# EAGLE schematic legatus_v0_2_with_notes (EAGLE 9.6.2)
CNAME: Parrot Teensy Board; CREVISION: 1.0; DESIGNER: Nathan Villicana-Shaw
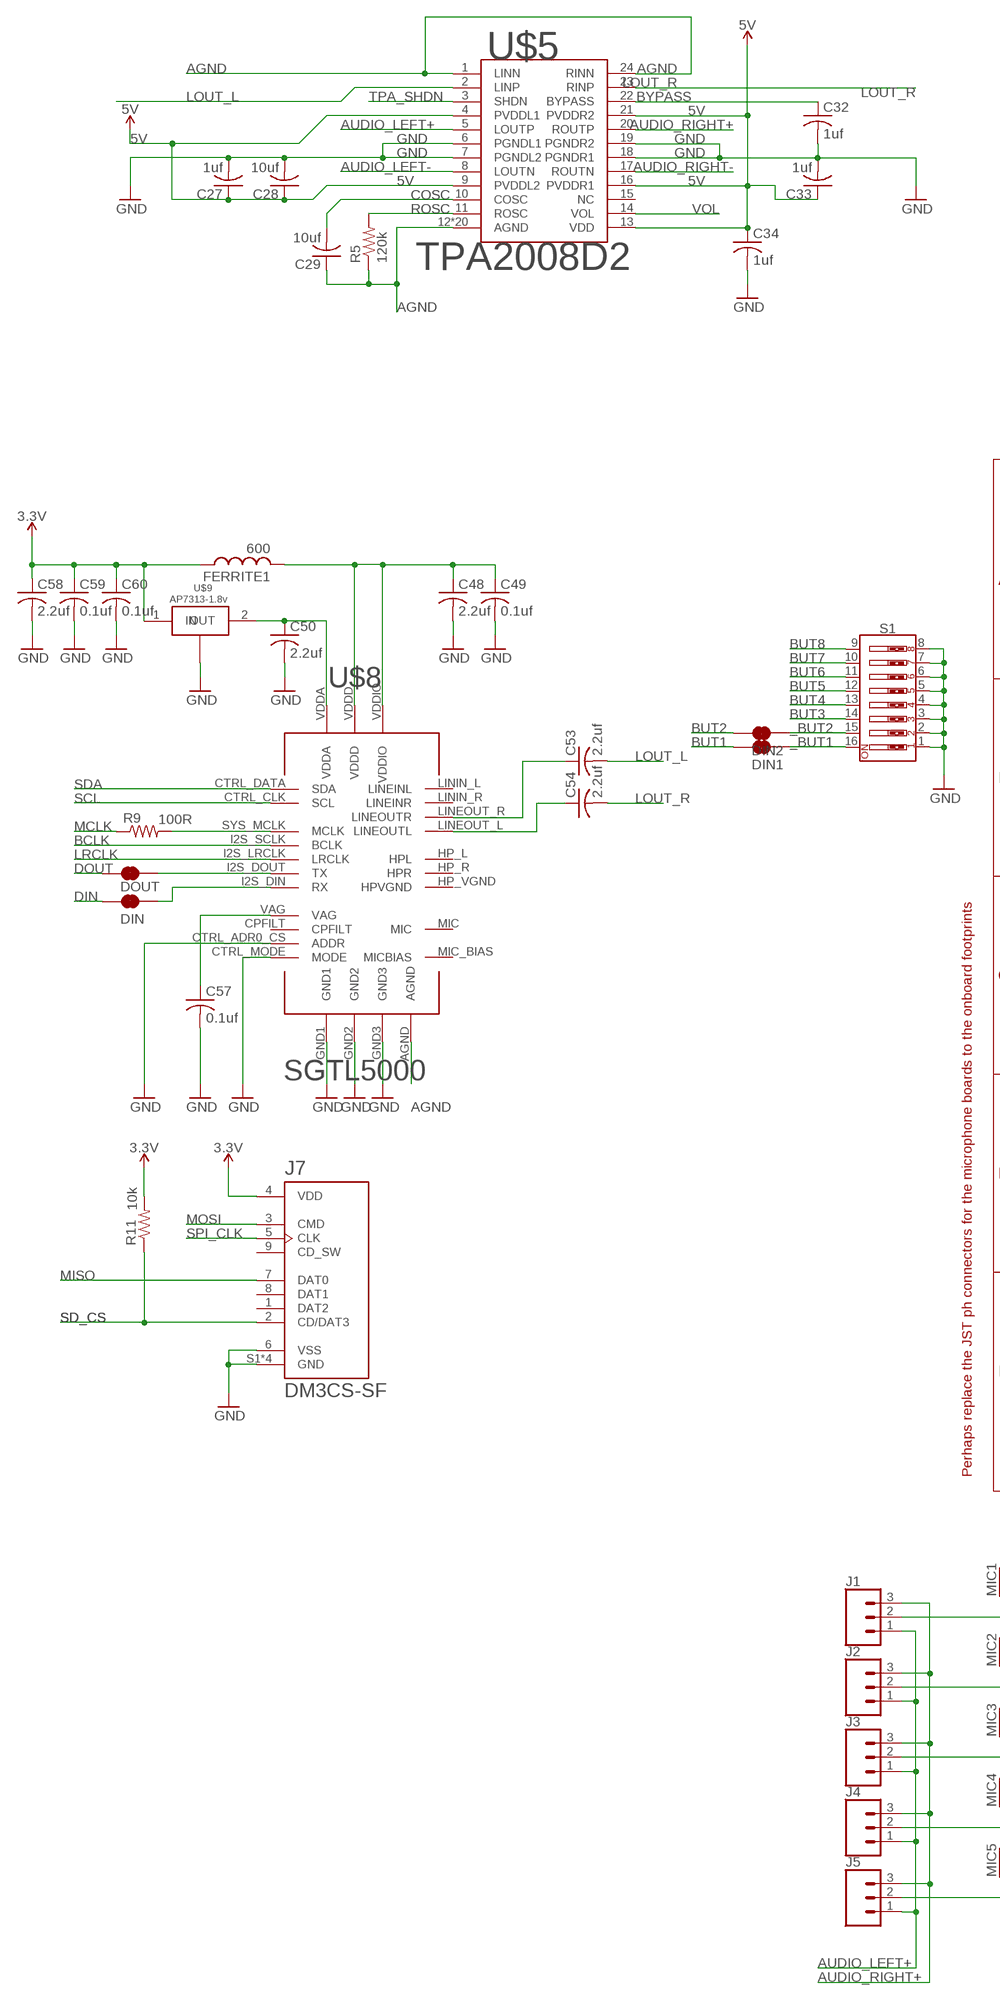
[diagram p0: schematic, sheet 1, part 1 of 2]
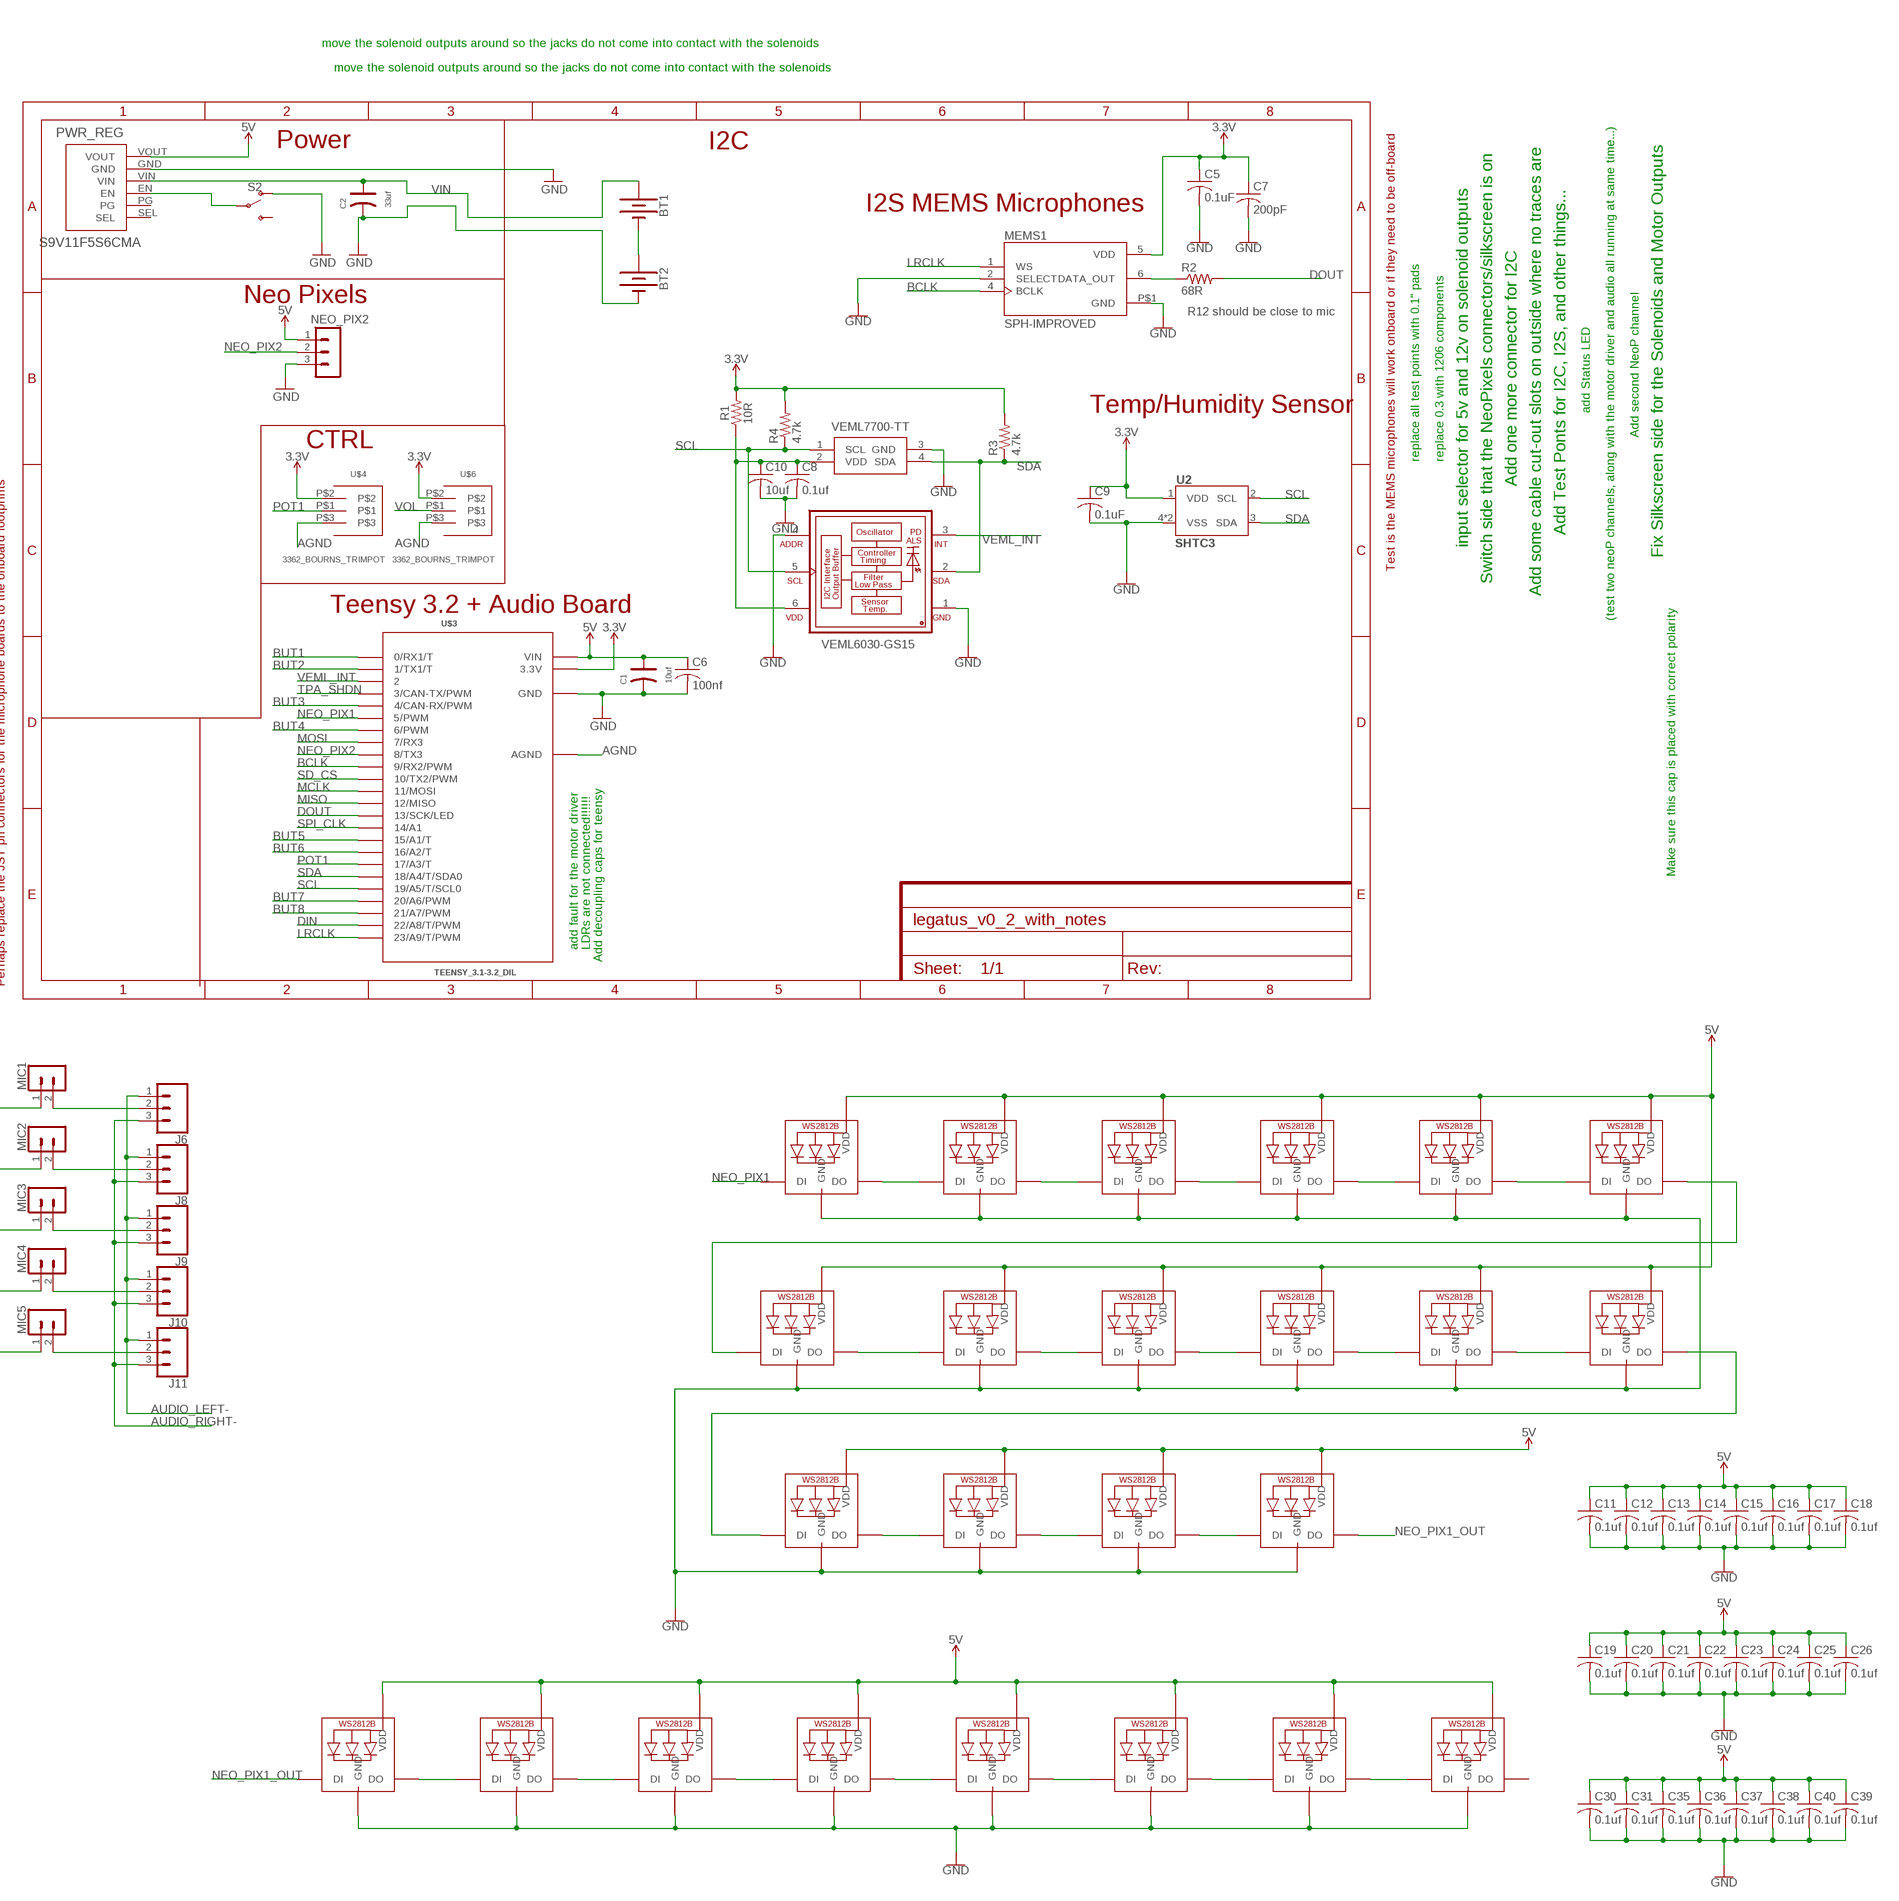
[diagram p1: schematic, sheet 1, part 2 of 2]

## Parts
BT1  BATTERY-18650  [BATTERY_18650-HOLDER]
BT2  BATTERY-18650  [BATTERY_18650-HOLDER]
C1  10uf  DIP-ALUMINUM-47UF-16V(D5-H7MM)  [PC-D5.3MM]
C2  33uf  DIP-ALUMINUM-47UF-16V(D5-H7MM)  [PC-D5.3MM]
C5  0.1uF  C-USC0805  [C0805]
C6  100nf  C-USC2012  [C2012]
C7  200pF  C-USC0805  [C0805]
C8  0.1uf  C-USC0805  [C0805]
C9  0.1uF  C-USC0805  [C0805]
C10  10uf  C-USC0805  [C0805]
C11  0.1uf  C-USC0805  [C0805]
C12  0.1uf  C-USC0805  [C0805]
C13  0.1uf  C-USC0805  [C0805]
C14  0.1uf  C-USC0805  [C0805]
C15  0.1uf  C-USC0805  [C0805]
C16  0.1uf  C-USC0805  [C0805]
C17  0.1uf  C-USC0805  [C0805]
C18  0.1uf  C-USC0805  [C0805]
C19  0.1uf  C-USC0805  [C0805]
C20  0.1uf  C-USC0805  [C0805]
C21  0.1uf  C-USC0805  [C0805]
C22  0.1uf  C-USC0805  [C0805]
C23  0.1uf  C-USC0805  [C0805]
C24  0.1uf  C-USC0805  [C0805]
C25  0.1uf  C-USC0805  [C0805]
C26  0.1uf  C-USC0805  [C0805]
C27  1uf  C-USC0805  [C0805]
C28  10uf  C-USC0805  [C0805]
C29  10uf  C-USC0805  [C0805]
C30  0.1uf  C-USC0805  [C0805]
C31  0.1uf  C-USC0805  [C0805]
C32  1uf  C-USC0805  [C0805]
C33  1uf  C-USC0805  [C0805]
C34  1uf  C-USC0805  [C0805]
C35  0.1uf  C-USC0805  [C0805]
C36  0.1uf  C-USC0805  [C0805]
C37  0.1uf  C-USC0805  [C0805]
C38  0.1uf  C-USC0805  [C0805]
C39  0.1uf  C-USC0805  [C0805]
C40  0.1uf  C-USC0805  [C0805]
C48  2.2uf  C-USC0805  [C0805]
C49  0.1uf  C-USC0805  [C0805]
C50  2.2uf  C-USC0805  [C0805]
C53  2.2uf  C-USC0805  [C0805]
C54  2.2uf  C-USC0805  [C0805]
C57  0.1uf  C-USC0805  [C0805]
C58  2.2uf  C-USC0805  [C0805]
C59  0.1uf  C-USC0805  [C0805]
C60  0.1uf  C-USC0805  [C0805]
DIN  JUMPER-SMT_2_NC_TRACE_SILK  [SMT-JUMPER_2_NC_TRACE_SILK]
DIN1  JUMPER-SMT_2_NC_TRACE_SILK  [SMT-JUMPER_2_NC_TRACE_SILK]
DIN2  JUMPER-SMT_2_NC_TRACE_SILK  [SMT-JUMPER_2_NC_TRACE_SILK]
DOUT  JUMPER-SMT_2_NC_TRACE_SILK  [SMT-JUMPER_2_NC_TRACE_SILK]
FERRITE1  600  INDUCTOR_0805_N  [RESC0805_N]
J1  CONN_03  [1X03]
J2  CONN_03  [1X03]
J3  CONN_03  [1X03]
J4  CONN_03  [1X03]
J5  CONN_03  [1X03]
J6  CONN_03  [1X03]
J7  DM3CS-SF  [HRS_DM3CS-SF]
J8  CONN_03  [1X03]
J9  CONN_03  [1X03]
J10  CONN_03  [1X03]
J11  CONN_03  [1X03]
LED1  WS2812B_5050N  [WS2812B-NARROW]
LED2  WS2812B_5050N  [WS2812B-NARROW]
LED3  WS2812B_5050N  [WS2812B-NARROW]
LED4  WS2812B_5050N  [WS2812B-NARROW]
LED5  WS2812B_5050N  [WS2812B-NARROW]
LED6  WS2812B_5050N  [WS2812B-NARROW]
LED7  WS2812B_5050N  [WS2812B-NARROW]
LED8  WS2812B_5050N  [WS2812B-NARROW]
LED9  WS2812B_5050N  [WS2812B-NARROW]
LED10  WS2812B_5050N  [WS2812B-NARROW]
LED11  WS2812B_5050N  [WS2812B-NARROW]
LED12  WS2812B_5050N  [WS2812B-NARROW]
LED13  WS2812B_5050N  [WS2812B-NARROW]
LED14  WS2812B_5050N  [WS2812B-NARROW]
LED15  WS2812B_5050N  [WS2812B-NARROW]
LED16  WS2812B_5050N  [WS2812B-NARROW]
LED17  WS2812B_5050N  [WS2812B-NARROW]
LED18  WS2812B_5050N  [WS2812B-NARROW]
LED19  WS2812B_5050N  [WS2812B-NARROW]
LED20  WS2812B_5050N  [WS2812B-NARROW]
LED21  WS2812B_5050N  [WS2812B-NARROW]
LED22  WS2812B_5050N  [WS2812B-NARROW]
LED23  WS2812B_5050N  [WS2812B-NARROW]
LED24  WS2812B_5050N  [WS2812B-NARROW]
MEMS1  SPH-IMPROVED  [MIC_SPH0645LM4H-B_LARGER_RING]
MIC1  B2B-PH-K  [B2B-PH-K]
MIC2  B2B-PH-K  [B2B-PH-K]
MIC3  B2B-PH-K  [B2B-PH-K]
MIC4  B2B-PH-K  [B2B-PH-K]
MIC5  B2B-PH-K  [B2B-PH-K]
NEO_PIX2  B3B-PH-K  [B3B-PH-K]
PWR_REG  S9V11F5S6CMA  [S9V11F3S5CMA]
R1  10R  R-US_R0805  [R0805]
R2  68R  R-US_M0805  [M0805]
R3  4.7k  R-US_M0805  [M0805]
R4  4.7k  R-US_M0805  [M0805]
R5  120k  R-US_M0805  [M0805]
R9  100R  R-US_M0805  [M0805]
R11  10k  R-US_M0805  [M0805]
S1  DIP-08-PTH  [DIPSWITCH-08]
S2  SWITCH-SPDT-PTH-11.6X4.0MM-LOCK  [SWITCH_SPDT_PTH_11.6X4.0MM_LOCK]
U2  SHTC3  [SHTC3]
U$3  TEENSY_3.1-3.2_DIL  [TEENSY_3.0-3.2&LC_DIL]
U$4  3362_BOURNS_TRIMPOT  [3362_BOURNS_TRIMPOT]
U$5  TPA2008D2  [PWP-TSSOP24]
U$6  3362_BOURNS_TRIMPOT  [3362_BOURNS_TRIMPOT]
U$8  SGTL5000  [QFN-32-5X5MM]
U$9  AP7313-1.8v  AP7313  [SOT-23]
VEML1  VEML7700-TT  [VEML7700]
VMEL1  VEML6030-GS15  [VISHAY_VEML6030_2X2X0.87]

## Nets
3.3V [3.3V]: C5.1 C7.1 C9.1 C58.1 C59.1 C60.1 FERRITE1.1 J7.4(VDD) MEMS1.5(VDD) R1.2 R3.2 R4.2 R11.2 U2.1(VDD) U$3.3.3V U$4.P$2 U$6.P$2 U$9.1(IN)
5V: C1.+ C6.1 C11.1 C12.1 C13.1 C14.1 C15.1 C16.1 C17.1 C18.1 C19.1 C20.1 C21.1 C22.1 C23.1 C24.1 C25.1 C26.1 C27.1 C28.1 C30.1 C31.1 C33.1 C34.1 C35.1 C36.1 C37.1 C38.1 C39.1 C40.1 LED1.1-VDD(VDD) LED2.1-VDD(VDD) LED3.1-VDD(VDD) LED4.1-VDD(VDD) LED5.1-VDD(VDD) LED6.1-VDD(VDD) LED7.1-VDD(VDD) LED8.1-VDD(VDD) LED9.1-VDD(VDD) LED10.1-VDD(VDD) LED11.1-VDD(VDD) LED12.1-VDD(VDD) LED13.1-VDD(VDD) LED14.1-VDD(VDD) LED15.1-VDD(VDD) LED16.1-VDD(VDD) LED17.1-VDD(VDD) LED18.1-VDD(VDD) LED19.1-VDD(VDD) LED20.1-VDD(VDD) LED21.1-VDD(VDD) LED22.1-VDD(VDD) LED23.1-VDD(VDD) LED24.1-VDD(VDD) NEO_PIX2.1 PWR_REG.VOUT U$3.VIN U$5.4(PVDDL1) U$5.9(PVDDL2) U$5.13(VDD) U$5.16(PVDDR1) U$5.21(PVDDR2)
_BUT1: DIN1.2 S1.16
_BUT2: DIN2.2 S1.15
AGND: C29.1 R5.1 U$3.AGND U$4.P$3 U$5.1(LINN) U$5.12(AGND) U$5.24(RINN) U$5.EXP(AGND) U$5.EXP@1(AGND) U$5.EXP@2(AGND) U$5.EXP@3(AGND) U$5.EXP@4(AGND) U$5.EXP@5(AGND) U$5.EXP@6(AGND) U$5.EXP@7(AGND) U$5.EXP@8(AGND) U$5.EXP@9(AGND) U$5.EXP@10(AGND) U$5.EXP@11(AGND) U$5.EXP@12(AGND) U$5.EXP@13(AGND) U$5.EXP@14(AGND) U$5.EXP@15(AGND) U$5.EXP@16(AGND) U$5.EXP@17(AGND) U$5.EXP@18(AGND) U$6.P$3 U$8.AGND
AUDIO_LEFT+: J1.1 J2.1 J3.1 J4.1 J5.1 U$5.5(LOUTP)
AUDIO_LEFT-: J6.1 J8.1 J9.1 J10.1 J11.1 U$5.8(LOUTN)
AUDIO_RIGHT+: J1.3 J2.3 J3.3 J4.3 J5.3 U$5.20(ROUTP)
AUDIO_RIGHT-: J6.3 J8.3 J9.3 J10.3 J11.3 U$5.17(ROUTN)
BCLK: MEMS1.4(BCLK) U$3.9(9/RX2/PWM) U$8.I2S_SCLK(BCLK)
BUT1: DIN1.1 U$3.0(0/RX1/T)
BUT2: DIN2.1 U$3.1(1/TX1/T)
BUT3: S1.14 U$3.4(4/CAN-RX/PWM)
BUT4: S1.13 U$3.6(6/PWM)
BUT5: S1.12 U$3.15/A1(15/A1/T)
BUT6: S1.11 U$3.16/A2(16/A2/T)
BUT7: S1.10 U$3.20/A6(20/A6/PWM)
BUT8: S1.9 U$3.21/A7(21/A7/PWM)
BYPASS: C32.1 U$5.22(BYPASS)
COSC: C29.2 U$5.10(COSC)
DIN: DIN.1 U$3.22/A8(22/A8/T/PWM)
DOUT: DOUT.1 R2.2 U$3.13(13/SCK/LED)
EDITROUTE: C48.1 C49.1 FERRITE1.2 U$8.VDDD U$8.VDDIO
GND: BT2.GND@1(-) C1.- C2.- C5.2 C6.2 C7.2 C8.2 C9.2 C10.2 C11.2 C12.2 C13.2 C14.2 C15.2 C16.2 C17.2 C18.2 C19.2 C20.2 C21.2 C22.2 C23.2 C24.2 C25.2 C26.2 C27.2 C28.2 C30.2 C31.2 C32.2 C33.2 C34.2 C35.2 C36.2 C37.2 C38.2 C39.2 C40.2 C48.2 C49.2 C50.2 C57.2 C58.2 C59.2 C60.2 J7.6(VSS) J7.S1(GND) J7.S2(GND) J7.S3(GND) J7.S5(GND) LED1.3-GND(GND) LED2.3-GND(GND) LED3.3-GND(GND) LED4.3-GND(GND) LED5.3-GND(GND) LED6.3-GND(GND) LED7.3-GND(GND) LED8.3-GND(GND) LED9.3-GND(GND) LED10.3-GND(GND) LED11.3-GND(GND) LED12.3-GND(GND) LED13.3-GND(GND) LED14.3-GND(GND) LED15.3-GND(GND) LED16.3-GND(GND) LED17.3-GND(GND) LED18.3-GND(GND) LED19.3-GND(GND) LED20.3-GND(GND) LED21.3-GND(GND) LED22.3-GND(GND) LED23.3-GND(GND) LED24.3-GND(GND) MEMS1.2(SELECT) MEMS1.P$1(GND) NEO_PIX2.3 PWR_REG.GND S1.1 S1.2 S1.3 S1.4 S1.5 S1.6 S1.7 S1.8 S2.1(O) U2.4(VSS) U2.5(VSS) U$3.GND U$5.6(PGNDL1) U$5.7(PGNDL2) U$5.18(PGNDR1) U$5.19(PGNDR2) U$8.CTRL_ADR0_CS(ADDR) U$8.CTRL_MODE(MODE) U$8.GND1 U$8.GND2 U$8.GND3 U$9.3(GND) VEML1.3(GND) VMEL1.1(GND) VMEL1.4(ADDR)
LOUT_L: C53.2 U$5.2(LINP)
LOUT_R: C54.2 U$5.23(RINP)
LRCLK: MEMS1.1(WS) U$3.23/A9(23/A9/T/PWM) U$8.I2S_LRCLK(LRCLK)
MCLK: R9.1 U$3.11(11/MOSI)
MISO: J7.7(DAT0) U$3.12(12/MISO)
MOSI: J7.3(CMD) U$3.7(7/RX3)
N$1: MEMS1.6(DATA_OUT) R2.1
N$2: J1.2 MIC1.1
N$3: J2.2 MIC2.1
N$4: C8.1 C10.1 R1.1 VEML1.2(VDD) VMEL1.6(VDD)
N$5: PWR_REG.EN S2.2(P)
N$6: J3.2 MIC3.1
N$7: J4.2 MIC4.1
N$8: J5.2 MIC5.1
N$9: LED1.2-DOUT(DO) LED2.4-DIN(DI)
N$10: LED2.2-DOUT(DO) LED3.4-DIN(DI)
N$11: LED3.2-DOUT(DO) LED4.4-DIN(DI)
N$12: LED4.2-DOUT(DO) LED5.4-DIN(DI)
N$13: LED5.2-DOUT(DO) LED6.4-DIN(DI)
N$14: LED7.2-DOUT(DO) LED8.4-DIN(DI)
N$15: LED8.2-DOUT(DO) LED9.4-DIN(DI)
N$16: LED9.2-DOUT(DO) LED10.4-DIN(DI)
N$17: LED10.2-DOUT(DO) LED11.4-DIN(DI)
N$18: LED11.2-DOUT(DO) LED12.4-DIN(DI)
N$19: LED13.2-DOUT(DO) LED14.4-DIN(DI)
N$20: LED14.2-DOUT(DO) LED15.4-DIN(DI)
N$21: LED15.2-DOUT(DO) LED16.4-DIN(DI)
N$22: BT1.GND@1(-) BT2.PWR@1(+)
N$23: LED12.2-DOUT(DO) LED13.4-DIN(DI)
N$24: LED6.2-DOUT(DO) LED7.4-DIN(DI)
N$25: J6.2 MIC1.2
N$26: LED18.2-DOUT(DO) LED19.4-DIN(DI)
N$27: C53.1 U$8.LINEOUT_R(LINEOUTR)
N$28: C54.1 U$8.LINEOUT_L(LINEOUTL)
N$29: LED19.2-DOUT(DO) LED20.4-DIN(DI)
N$30: LED20.2-DOUT(DO) LED21.4-DIN(DI)
N$31: LED21.2-DOUT(DO) LED22.4-DIN(DI)
N$32: J8.2 MIC2.2
N$33: LED22.2-DOUT(DO) LED23.4-DIN(DI)
N$34: C57.1 U$8.VAG
N$35: DIN.2 U$8.I2S_DIN(RX)
N$36: DOUT.2 U$8.I2S_DOUT(TX)
N$37: LED23.2-DOUT(DO) LED24.4-DIN(DI)
N$38: R9.2 U$8.SYS_MCLK(MCLK)
N$39: C50.1 U$8.VDDA U$9.2(OUT)
N$40: J9.2 MIC3.2
N$42: J10.2 MIC4.2
N$43: LED17.2-DOUT(DO) LED18.4-DIN(DI)
N$44: J11.2 MIC5.2
NEO_PIX1: LED1.4-DIN(DI) U$3.5(5/PWM)
NEO_PIX1_OUT: LED16.2-DOUT(DO) LED17.4-DIN(DI)
NEO_PIX2: NEO_PIX2.2 U$3.8(8/TX3)
POT1: U$3.17/A3(17/A3/T) U$4.P$1
ROSC: R5.2 U$5.11(ROSC)
SCL: R4.1 U2.2(SCL) U$3.19/A5(19/A5/T/SCL0) U$8.CTRL_CLK(SCL) VEML1.1(SCL) VMEL1.5(SCL)
SD_CS: J7.2(CD/DAT3) R11.1 U$3.10(10/TX2/PWM)
SDA: R3.1 U2.3(SDA) U$3.18/A4(18/A4/T/SDA0) U$8.CTRL_DATA(SDA) VEML1.4(SDA) VMEL1.2(SDA)
SPI_CLK: J7.5(CLK) U$3.14/A0(14/A1)
TPA_SHDN: U$3.3(3/CAN-TX/PWM) U$5.3(SHDN)
VEML_INT: U$3.2 VMEL1.3(INT)
VIN [12V_IN]: BT1.PWR@1(+) C2.+ PWR_REG.VIN
VOL: U$5.14(VOL) U$6.P$1
Unconnected: J7.1(DAT2) J7.8(DAT1) J7.9(CD_SW) LED24.2-DOUT(DO) PWR_REG.PG PWR_REG.SEL S2.3(S) U$5.15(NC) U$8.CPFILT U$8.HP_L(HPL) U$8.HP_R(HPR) U$8.HP_VGND(HPVGND) U$8.LININ_L(LINEINL) U$8.LININ_R(LINEINR) U$8.MIC U$8.MIC_BIAS(MICBIAS)

## Notes on the sheet
- move the solenoid outputs around so the jacks do not come into contact with the solenoids
- move the solenoid outputs around so the jacks do not come into contact with the solenoids
- Power | Fix Silkscreen side for the Solenoids and Motor Outputs
- I2C
- I2S MEMS Microphones
- Neo Pixels
- R12 should be close to mic
- Temp/Humidity Sensor | add Status LED
- 10R
- Add second NeoP channel
- CTRL
- replace all test points with 0.1" pads | replace 0.3 with 1206 components
- Add one more connector for I2C
- Add Test Ponts for I2C, I2S, and other things...
- input selector for 5v and 12v on solenoid outputs
- Test is the MEMS microphones will work onboard or if they need to be off-board
- Switch side that the NeoPixels connectors/silkscreen is on
- Add some cable cut-out slots on outside where no traces are
- Teensy 3.2 + Audio Board
- (test two neoP channels, along with the motor driver and audio all running at same time...)
- Make sure this cap is placed with correct polarity
- add fault for the motor driver | LDRs are not connected!!!!!!
- Add decoupling caps for teensy
- Perhaps replace the JST ph connectors for the microphone boards to the onboard footprints

## Library data of the parts
BT1 BT2 = SparkFun-Batteries:BATTERY: Battery - Single Cell A variety of battery chemistries, sizes, and footprints. Device List: 20MM_PTH - Coin Cell Battery Holder - 20mm (PTH) <https://www.sparkfun.com/products/783> 6.8MM_PTH - Coin Cell Battery Holder - 6.8MM(SMD) <https://www.digikey.com/product-detail/en/seiko-instruments/MS621FE-FL11E/728-1057-ND/1889208?WT.srch=1&gclid=CNOQ5a6LzdQCFZS2wAodXCkE0g> 12MM_SMD - Coin Cell Battery Holder - 12mm (SMD) <https://www.sparkfun.com/products/10592> 12MM_PTH - Coin Cell Battery Holder - 12mm (PTH) <https://www.sparkfun.com/products/7948> 20MM_SMD - 20mm Coin Cell Battery Holder (SMD) (2 legs) Used on the Big Time Watch Kit <https://www.sparkfun.com/products/11734> 20MM_SMD_4LEGS - Coin Cell Battery Holder - 20mm (SMD) <https://www.sparkfun.com/products/11892> 20MM_SMD_4LEGS_OVERPASTE - Coin Cell Battery Holder - 20mm (SMD) <https://www.sparkfun.com/products/11892> (Over-paste on the legs) 24.5MM_PTH - Coin Cell Battery Holder - 24.5mm (PTH) <https://www.sparkfun.com/products/8863> 9V - 9V Battery Holder - PC Mount Used on the SparkFun SparkPunk Sound Kit <https://www.sparkfun.com/products/11177> and SparkFun SparkPunk Sequencer Kit <https://www.sparkfun.com/products/12707> 18650 - Battery Holder - 18650 (PTH) <https://www.sparkfun.com/products/13113> AA - Battery Holder - 1xAA (PTH) <https://www.sparkfun.com/products/7949> AAA - Battery Holder - 1xAAA (PTH) <https://www.sparkfun.com/products/12718> AA_KIT - Battery Holder - 1xAA (PTH) <https://www.sparkfun.com/products/7949> Special kit package - pads only have exposed copper on one side of the board. AAA_KIT - Battery Holder - 1xAAA (PTH) <https://www.sparkfun.com/products/12718> Special kit package - pads only have exposed copper on one side of the board.; PROD_ID: BATT-12327; SF_SKU: PRT-13113
C1 C2 = Seeed-Capacitor:DIP-ALUMINUM-47UF-16V(D5-H7MM): 302030033; MPN: KS 100uF/16V; VALUE: 100uf
C5 C7-C40 C48-C50 C53 C54 C57-C60 = rcl:C-US: CAPACITOR, American symbol; SPICEPREFIX: C
C6 = adafruit:C-US: CAPACITOR, American symbol
DIN DIN1 DIN2 DOUT = SparkFun-Jumpers:JUMPER-SMT_2_NC_TRACE: Normally closed trace jumper This jumper has a trace between two pads so it's normally closed (NC). Use a razor knife to open the connection. For best results follow the IPC guidelines for cutting traces: Cutout at least 0.063 mm (0.005 in). Remove all loose material to clean up the cut area. Seal the cut with an approved epoxy. Reapply solder to reclose the connection.
FERRITE1 = Nordic_nRF:INDUCTOR: Generic chip inductor
J1-J6 J8-J11 = SparkFun-Connectors:CONN_03: Multi connection point. Often used as Generic Header-pin footprint for 0.1 inch spaced/style header connections On any of the 0.1 inch spaced packages, you can populate with these: Break Away Headers - Straight <https://www.sparkfun.com/products/116> (PRT-00116) Break Away Male Headers - Right Angle <https://www.sparkfun.com/products/553> (PRT-00553) Female Headers <https://www.sparkfun.com/products/115> (PRT-00115) Break Away Headers - Machine Pin <https://www.sparkfun.com/products/117> (PRT-00117) Break Away Female Headers - Swiss Machine Pin <https://www.sparkfun.com/products/743> (PRT-00743) Stackable Header - 3 Pin (Female, 0.1") <https://www.sparkfun.com/products/13875> (PRT-13875) For SCREWTERMINALS and SPRING TERMINALS visit here: Screw Terimnals on SparkFun.com <https://www.sparkfun.com/search/results?term=Screw+Terminals> (5mm/3.5mm/2.54mm spacing) This device is also useful as a general connection point to wire up your design to another part of your project. Our various solder wires solder well into these plated through hole pads. Hook-Up Wire - Assortment (Stranded, 22 AWG) <https://www.sparkfun.com/products/11375> (PRT-11375) Hook-Up Wire - Assortment (Solid Core, 22 AWG) <https://www.sparkfun.com/products/11367> (PRT-11367) View the entire wire category on our website here <https://www.sparkfun.com/categories/141> Special notes: Molex polarized connector foot print use with SKU : PRT-08232 with associated crimp pins and housings.
J7 = DM3CS-SF:DM3CS-SF: CONN MICRO SD CARD HINGED TYPE; AVAILABILITY: Unavailable; DESCRIPTION: 10 (8 + 2) Position Card Connector Secure Digital - microSD™ Surface Mount, Right Angle Gold; MF: Hirose; MP: DM3CS-SF; PACKAGE: None; PRICE: None
LED1-LED24 = nathans-custom-parts:WS2812B
MEMS1 = SPH0645LM4H-B:SPH-IMPROVED
MIC1-MIC5 = con-jst-ph:B2B-PH-K: HEADER
NEO_PIX2 = con-jst-ph:B3B-PH-K: HEADER
PWR_REG = nathans-custom-parts:S9V11F5S6CMA
R1 = audio amplifier example:R-US_: RESISTOR, American symbol
R2-R5 = adafruit:R-US_: RESISTOR, American symbol
R9 R11 = rcl:R-US_: RESISTOR, American symbol; SPICEPREFIX: R
S1 = SparkFun-Switches:DIP-08: 8-Position DIP Switch 8-circuit DIP (dual inline package) switch. Commonly used to physcially set a circuit's behavior. SparkFun Products DIP Switch - 8 Position <https://www.sparkfun.com/products/8034> (COM-08034); PROD_ID: SWCH-12197; SF_SKU: COM-08034
S2 = SparkFun-Switches:SWITCH-SPDT: Single Pole, Double Throw (SPDT) Switch Single-pole, double-throw (SPDT) switch. Variant Overview SMD-AYZ0202 Surface Mount DPDT Switch <https://www.sparkfun.com/products/597> (COM-00597) Used on e.g. LilyPad Arduino USB - ATmega32U4 Board <https://www.sparkfun.com/products/12049> PTH-11.6X4.0MM SPDT Mini Power Switch <https://www.sparkfun.com/products/102> (COM-00102) Used on e.g. SparkFun Simon Says - Through-Hole Soldering Kit <https://www.sparkfun.com/products/10547> (KIT-10547) PTH-11.6X4.0MM-KIT KIT version of SPDT Mini Power Switch - Simplifies soldering by removing tStop of switch pins - only one side can be soldered. PTH-11.6X4.0MM-LOCK LOCK version of SPDT Mini Power Switch - Offset pins hold switch in place for easier soldering. SMD-RIGHT-ANGLE Surface Mount Right Angle Switch <https://www.sparkfun.com/products/10860> (COM-10860) Used on e.g. SparkFun ESP8266 Thing <https://www.sparkfun.com/products/13231>; PROD_ID: SWCH-08261; SF_SKU: COM-00102
U2 = SHTC3:SHTC3
U$3 = teensy_3_and_LC:TEENSY_3.1-3.2_DIL: Teensy 3.1 or 3.2 in a DIL Layout.
U$4 U$6 = nathans-custom-parts:3362_BOURNS_TRIMPOT
U$5 = TPA2008D3:TPA2008D2
U$8 = sgtl5000:SGTL5000
U$9 = AP7313:AP7313
VEML1 = VEML7700-TT:VEML7700-TT: 16Bit Ambient Light Sensor I2C 6.8x2.3mm Source: Datasheet <https://www.arrow.com/en/products/veml7700-tt/vishay>; DESCRIPTION: 16Bit Ambient Light Sensor I2C 6.8x2.3mm; HEIGHT: mm; MANUFACTURER_NAME: Vishay; MANUFACTURER_PART_NUMBER: VEML7700-TT; MOUSER_PART_NUMBER: 78-VEML7700-TT; MOUSER_PRICE-STOCK: https://www.mouser.com/Search/Refine.aspx?Keyword=78-VEML7700-TT; RS_PART_NUMBER: 1226791P; RS_PRICE-STOCK: http://uk.rs-online.com/web/p/products/1226791P
VMEL1 = VEML6030-GS15:VEML6030-GS15: VEML6030 High Accuracy Ambient Light Sensor with I2C Interface: VEML6030 is a high accuracy ambient light digital 16-bit resolution sensor in a miniature transparent 2 mm x 2 mm package. It includes a high sensitive photodiode, a low noise amplifier, a 16-bit A/D converter and supports an easy to use I2C bus communication interface and additional interrupt feature. The ambient light result is as digital value available. Device Model created 15.06.2016 by Johannes Kolb - Vishay Semiconductor GmbH; AVAILABILITY: Unavailable; DESCRIPTION: Optical Sensor Ambient 550nm I²C 6-SMD, No Lead; MF: Vishay Semiconductor; MP: VEML6030-GS15; PACKAGE: SMD-6 Vishay; PRICE: None

## Net classes
0 default: width 0.203 mm, drill 0.254 mm, clearance 0.203 mm
1 12V_IN: width 1.016 mm, drill 0.762 mm, clearance 0.305 mm
2 3.3V: width 0.305 mm, drill 0.508 mm, clearance 0.254 mm
3 5V: width 0.787 mm, drill 0.508 mm, clearance 0.381 mm